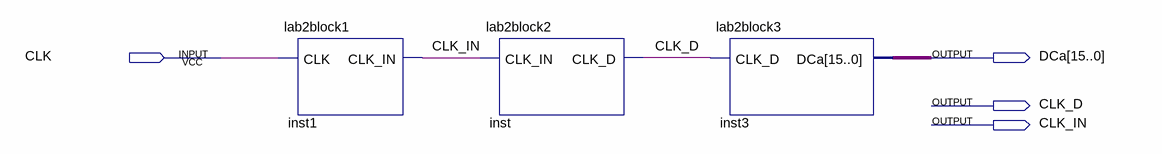
[diagram p0: schematic sheet]
// Quartus schematic lab2.bdf as structural Verilog: 3 symbols, 4 pins
module lab2 (
  input  CLK,
  output [15:0] DCa,
  output CLK_D,
  output CLK_IN
);

  lab2block1 inst1 (.CLK(CLK), .CLK_IN(CLK_IN));
  lab2block2 inst (.CLK_IN(CLK_IN), .CLK_D(CLK_D));
  lab2block3 inst3 (.CLK_D(CLK_D), .DCa(DCa));
endmodule
